# EAGLE design SolarCharger (EAGLE 5.12)
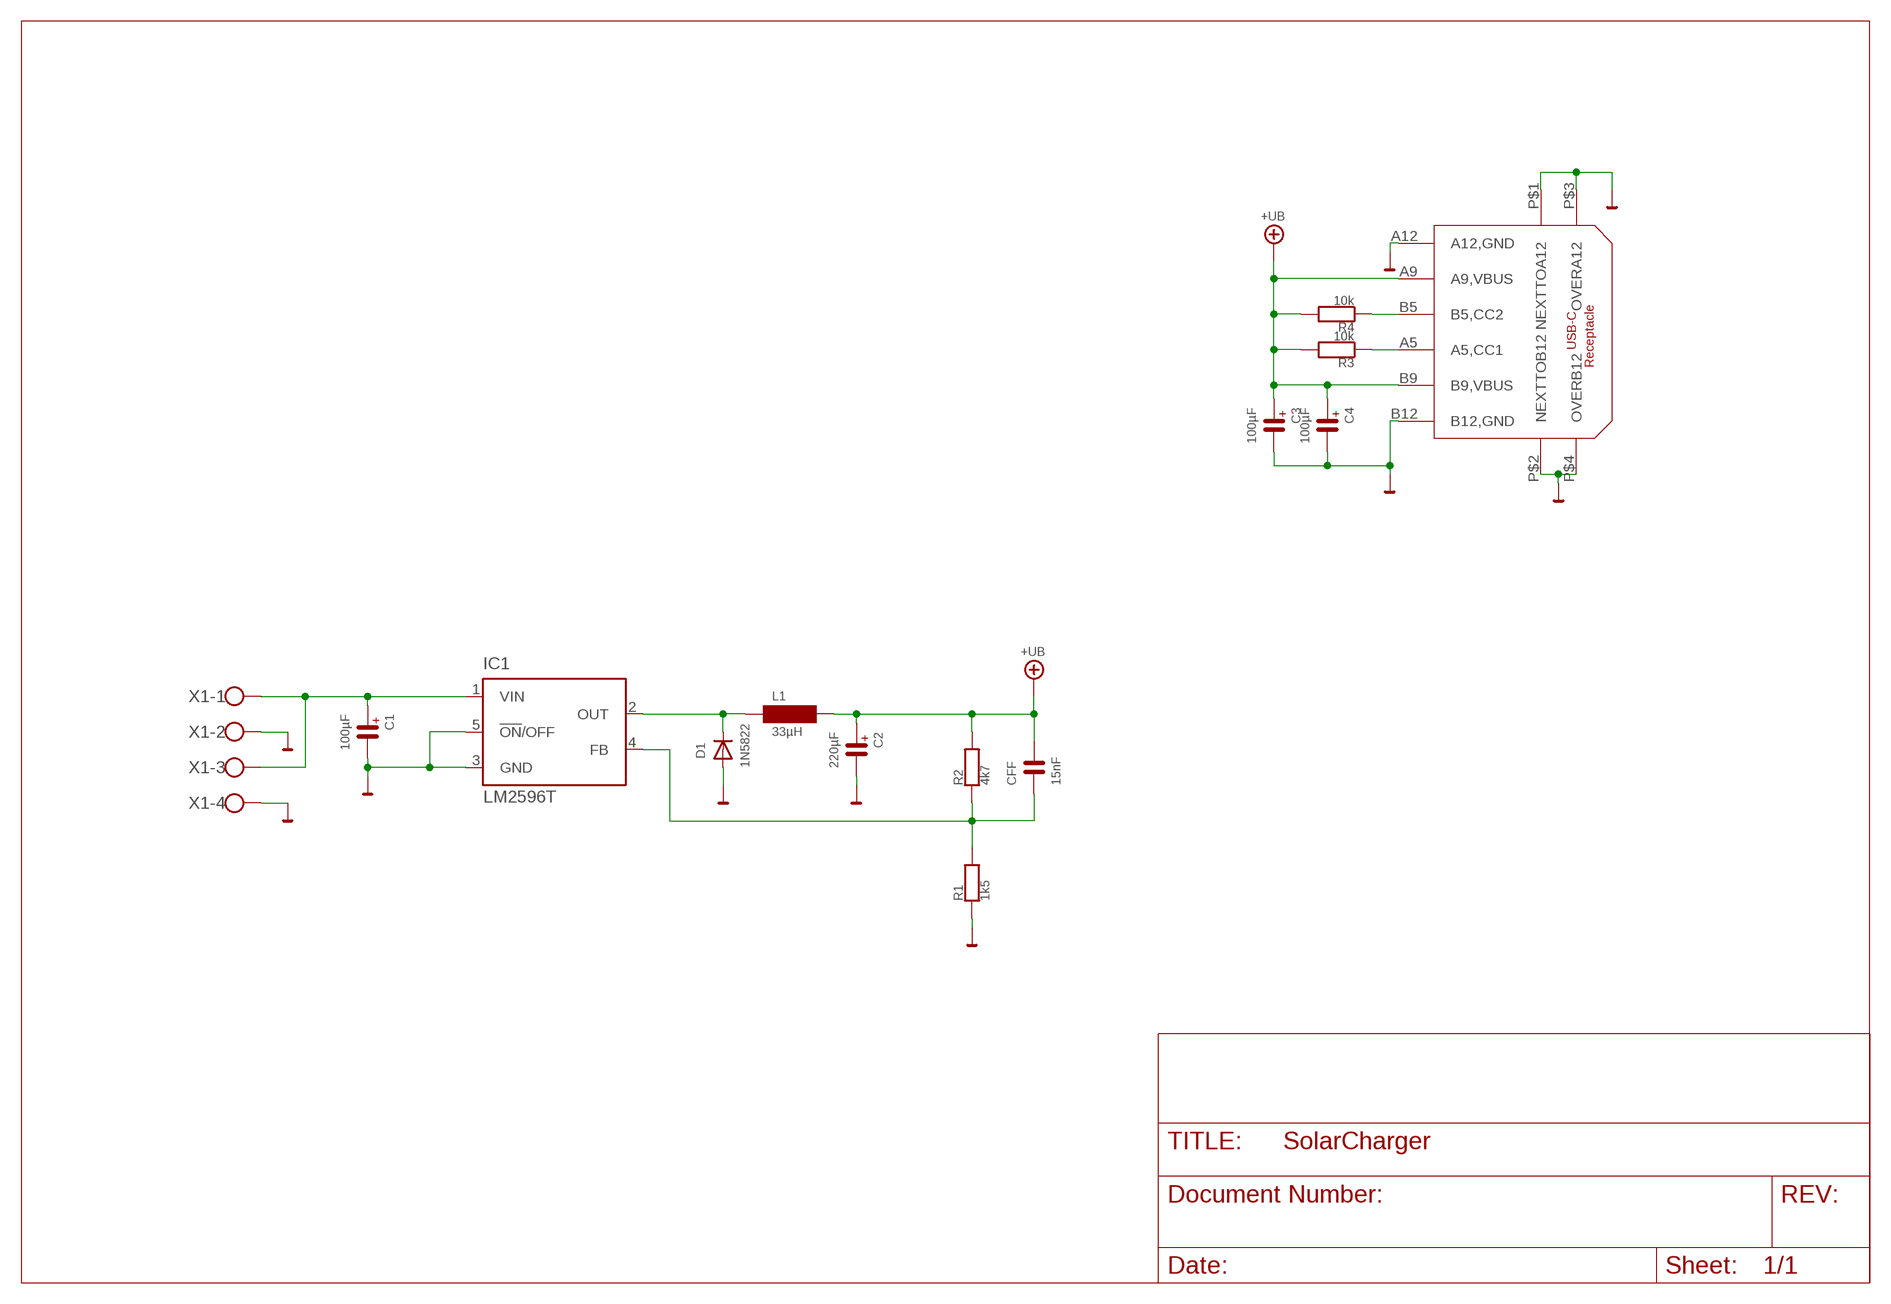
[diagram p0: schematic, sheet 1]

## Parts
C1  100µF  CPOL-EUE5-13  [E5-13]
C2  220µF  CPOL-EUE5-8.5  [E5-8,5]
C3  100µF  CPOL-EUE5-10.5  [E5-10,5]
C4  100µF  CPOL-EUE5-10.5  [E5-10,5]
CFF  15nF  C-EU050-030X075  [C050-030X075]
D1  1N5822  1N5624  [DO201-15]
IC1  LM2596T  [T05D]
L1  33µH  L  [AMRM00101040]
R1  1k5  R-EU_0309/12MM-5E  [0309/12]
R2  4k7  R-EU_0309/12MM-5E  [0309/12]
R3  10k  R-EU_0309/12MM-5E  [0309/12]
R4  10k  R-EU_0309/12MM-5E  [0309/12]
U$1  USB-C-RECEPTACLE  [6-PIN-USB-C-RECEPTACLE]
X1  W237-4  [W237-4]

## Nets
+UB: C2.+ C3.+ C4.+ CFF.1 L1.2 R2.2 R3.2 R4.2 U$1.A9(A9,VBUS) U$1.B9(B9,VBUS)
GND: C1.- C2.- C3.- C4.- D1.A IC1.3(GND) IC1.5(!ON!/OFF) R1.1 U$1.A12(A12,GND) U$1.B12(B12,GND) U$1.P$1(NEXTTOA12) U$1.P$2(NEXTTOB12) U$1.P$3(OVERA12) U$1.P$4(OVERB12) X1.2 X1.4
N$1: D1.C IC1.2(OUT) L1.1
N$3: CFF.2 IC1.4(FB) R1.2 R2.1
N$4: C1.+ IC1.1(VIN) X1.1 X1.3
N$5: R3.1 U$1.A5(A5,CC1)
N$6: R4.1 U$1.B5(B5,CC2)

## Library data of the parts
C1-C4 = HTL-RCL:CPOL-EU: POLARIZED CAPACITOR, European symbol
CFF = HTL-RCL:C-EU: CAPACITOR, European symbol
D1 = HTL-diode:1N5624: DIODE controlled avalanche rectifier
IC1 = national-semiconductor:LM2596: SIMPLE SWITCHER® Power Converter 150 kHz 3A Step-Down Voltage Regulator Source: http://www.national.com/ds/LM/LM2596.pdf; MPN: LM2596T-ADJ/LF02; OC_FARNELL: 9494162; OC_NEWARK: 65K5910
L1 = hel-diverses:L: SMD-Spule 11,6 x 10,2 mm Pulse AMRM00101040 Type
R1-R4 = HTL-RCL:R-EU_: Resistor, European symbol
U$1 = hel-diverses:USB-C-RECEPTACLE: USB Type C-Buchse Mouser-Artikelnummer: 649-10164359-00011LF
X1 = con-wago-500:W237-4: WAGO SCREW CLAMP; OC_FARNELL: unknown; OC_NEWARK: unknown

## Board
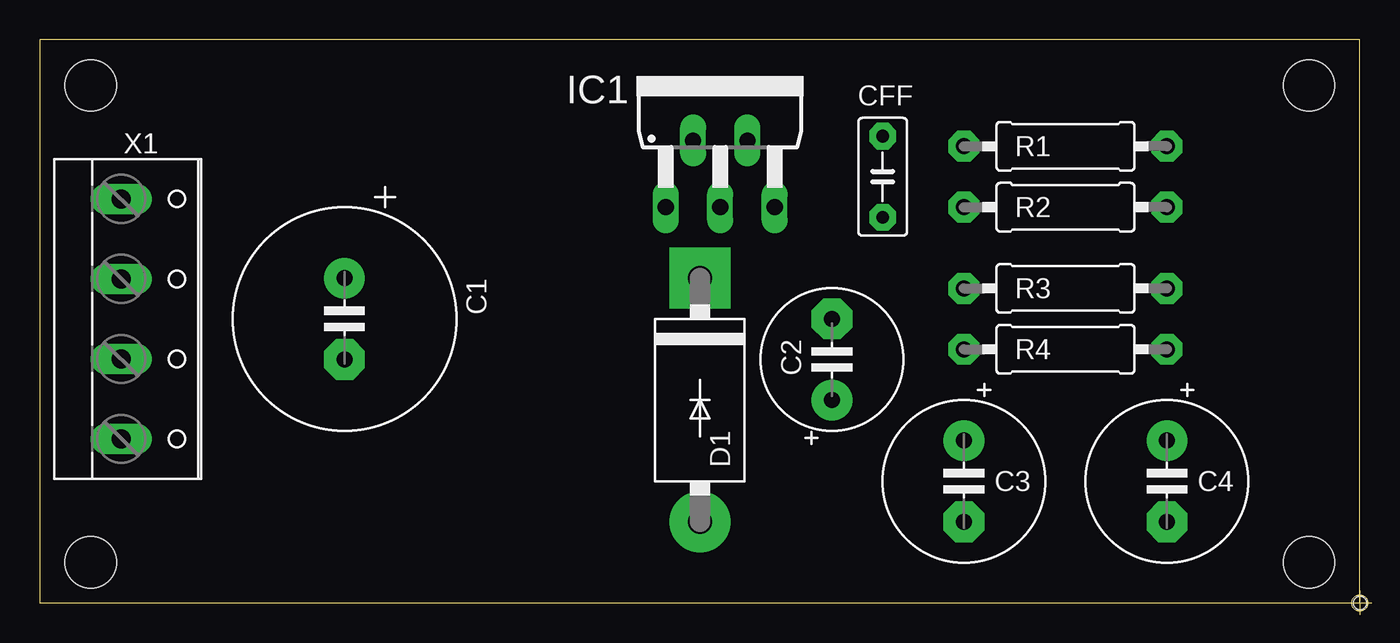
[diagram p1: board, top side]
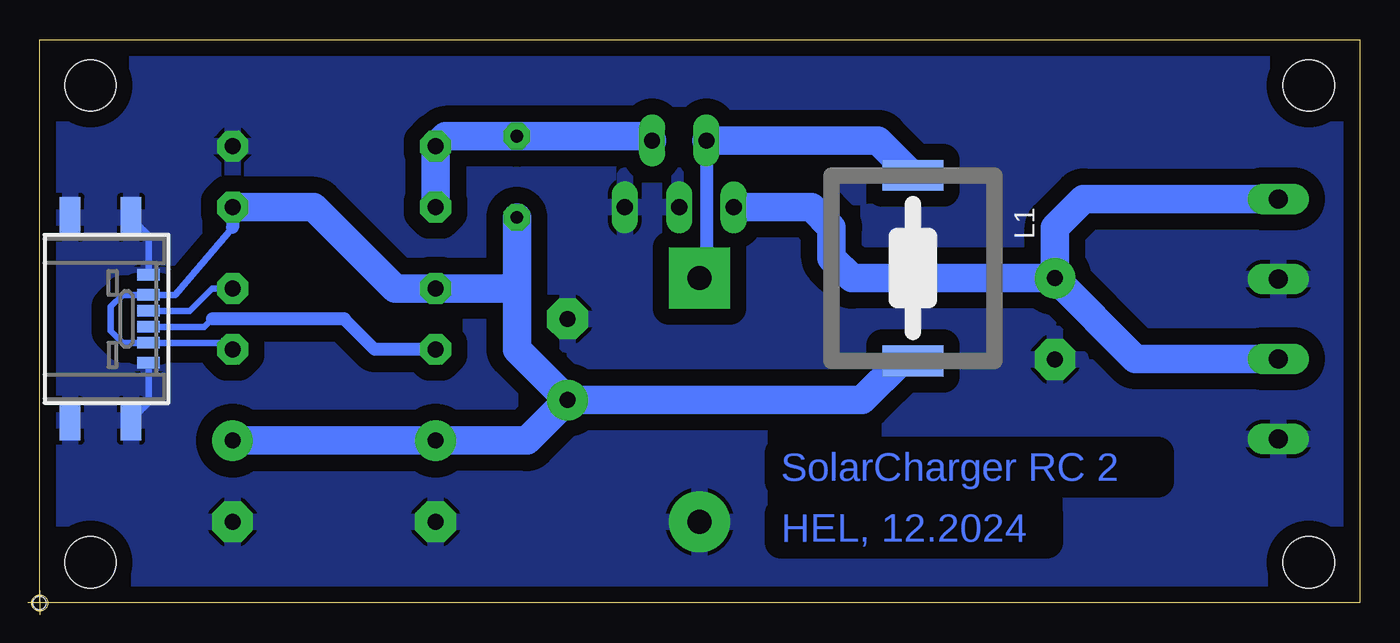
[diagram p2: board, bottom side, seen from below]

Size 82.53 x 35.23 mm. Coordinates in mm from the lower left corner, seen from the top.
Outline: 0,0 82.53,0 82.53,35.23 0,35.23 0,0
Copper layers (1*16): Top 0.035mm / dielectric 1.5mm / Bottom 0.035mm
Design rules "default": minimum track width 25mil, minimum drill 24mil, track to track 40mil, track to pad 40mil, pad to pad 25mil, via to via 25mil, smd to smd 12mil, copper to edge 40mil, drill to drill 8mil, minimum pad ring 10mil, minimum via ring 15mil, stop-mask expansion 0mil, vias tented up to drill 0mil, thermal gap 10mil
Holes 3.2 mm at 3.17,32.38 3.17,2.54 79.38,32.38 79.38,2.54

### Footprints (pad centres in the part's own frame; a part is rotated, then mirrored left to right if it is on the bottom)
E5-13 = drill 1 pad 2.54 round: + -2.54,0 | drill 1 pad 2.54 octagon: - 2.54,0
E5-8,5 = drill 1 pad 2.54 round: + -2.54,0 | drill 1 pad 2.54 octagon: - 2.54,0
E5-10,5 = drill 1 pad 2.54 round: + -2.54,0 | drill 1 pad 2.54 octagon: - 2.54,0
C050-030X075 = drill 0.8 pad 1.676 octagon: 1 -2.54,0; 2 2.54,0
DO201-15 = drill 1.5 pad 3.81 round: A 7.62,0 | drill 1.5 pad 3.81 square: C -7.62,0
T05D = drill 1.016 long: 1 -3.404,-5.08; 2 -1.702,-0.914; 3 0,-5.08; 4 1.702,-0.914; 5 3.404,-5.08
AMRM00101040 = smd 1.93 x 3.81: 1 -5.8,0; 2 5.8,0
0309/12 = drill 1 pad 1.93 octagon: 1 -6.35,0; 2 6.35,0
6-PIN-USB-C-RECEPTACLE = smd 0.711 x 1.422: A5 -0.5,3; A9 1.5,3; A12 2.75,3; B5 0.5,3; B9 -1.5,3; B12 -2.75,3 | smd 2.54 x 1.27: P$1 -6.35,1.905; P$2 -6.35,-1.905; P$3 6.35,1.905; P$4 6.35,-1.905
NULLPUNKT = hole 0.8: 0,0
W237-4 = drill 1.194 long: 1 -7.5,-1.27; 2 -2.5,-1.27; 3 2.5,-1.27; 4 7.5,-1.27

### Placement (x,y rotation side)
C1  19.05,17.78 270 top
C2  49.53,15.24 90 top
C3  57.78,7.62 270 top
C4  70.48,7.62 270 top
CFF  52.7,26.67 90 top
D1  41.27,12.7 270 top
IC1  42.55,29.84 0 top
L1  27.94,20.95 270 bottom
R1  64.14,28.57 180 top
R2  64.14,24.77 0 top
R3  64.14,19.68 180 top
R4  64.14,15.88 0 top
U$1  78.74,17.78 270 bottom
U$2  [NULLPUNKT]  82.55,0 0 top
X1  6.35,17.78 270 top

### Tracks (layer width: path | path; a pad name or v marks a point on that pad's centre or on a via)
+UB
  Bottom 0.406: 70.48,23.5 74.06,19.28 U$1.B9 77.37,19.28 78.11,18.54 78.11,17.02 77.34,16.26 75.76,16.26 U$1.A9 70.89,16.28
  Bottom 0.813: 70.89,16.28 R4.2 | R2.2 70.48,23.5
  Bottom 1.778: C2.+ 31.11,12.7 28.66,15.15 L1.2 | 52.7,19.68 52.7,15.88 C2.+ | 52.7,19.68 CFF.1 | 52.7,19.68 R3.2 60.33,19.68 65.41,24.77 R2.2 | C3.+ C4.+ 52.07,10.16 C2.+
GND
  Bottom 0.406: U$1.A12 75.74,12.53 U$1.P$3 | U$1.B12 75.74,23.04 U$1.P$1
  Bottom 0.813: R1.1 70.48,28.29
  pour Bottom (isolate 1.016): 0,34.92 82.55,34.92 82.55,0 0,0
N$1
  Bottom 0.813: IC1.2 40.84,20.75
  Bottom 1.27: 40.84,20.75 D1.C
  Bottom 1.778: IC1.2 30.12,28.93 L1.1
N$3
  Bottom 1.778: R2.1 R1.2 57.15,29.21 CFF.2 44.53,29.21 IC1.4
N$4
  Bottom 1.27: 38.73,24.77 IC1.1
  Bottom 1.778: C1.+ 31.75,20.32 33.02,21.59 33.02,23.5 34.29,24.77 38.73,24.77 | X1.1 17.27,25.28 19.05,23.5 C1.+ | X1.3 14.01,15.28 C1.+
N$5
  Bottom 0.406: R3.1 71.75,19.68 73.16,18.28 U$1.A5
N$6
  Bottom 0.406: 71.75,17.78 72.25,17.28 U$1.B5
  Bottom 0.813: 71.75,17.78 63.5,17.78 61.59,15.88 R4.1

### Text on the board
Bottom: SolarCharger RC 2 | HEL, 12.2024